# EAGLE design FM Radio Simple Receiver (EAGLE 7.2.0)
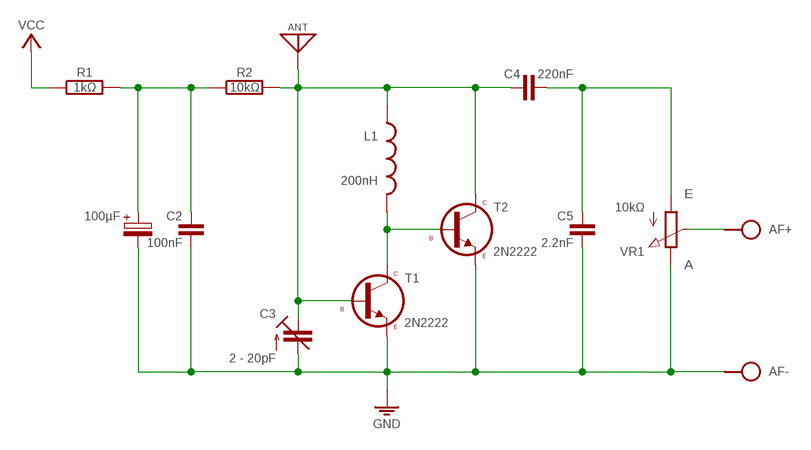
[diagram p0: schematic, sheet 1]

## Parts
100µF  CPOLE2,5-5/V  [E2,5-5/V]
AF  SPAD+-+-  [SPAD+-]
ANT  ANT  [SPAD]
BAT  VCC_GNDL  [SPAD-+]
C2  100nF  C050-020X036/V  [C050-020X036/V]
C3  2 - 20pF  C-TR-PH20127  [TRIM-2222-808]
C4  220nF  C-H050-020X044  [C050-020X044]
C5  2.2nF  C050-020X036/V  [C050-020X036/V]
L1  200nH  L04/7-V  [L-04/7-V]
R1  1kΩ  R-H0204/10  [0204/10]
R2  10kΩ  R-H0204/10  [0204/10]
T1  2N2222  [TO92-EBC]
T2  2N2222  [TO92-EBC]
VR1  10kΩ  POT  [POT]

## Nets
GND: 100µF.- AF.1 BAT.1 C2.2 C3.1(A) C3.3(A) C5.2 T1.E T2.E VR1.E
N$1: ANT.1 C3.2(E) C4.1 L1.1 R2.2 T1.B T2.C
N$2: 100µF.+ C2.1 R1.2 R2.1
N$3: C4.2 C5.1 VR1.A
N$5: L1.2 T1.C T2.B
N$6: AF.2 VR1.S
VCC: BAT.2 R1.1

## Library data of the parts
100µF = c:CPOL: POLARIZED CAPACITOR, European symbol
AF = pad:SPAD+-
ANT = pad:ANT
BAT = pad:VCC_GND
C2 C5 = c:C: CAPACITOR, European symbol
C3 = cap-trim:C-TR-PH20127
C4 = c:C-H
L1 = l:L: Potentiometers Beckman, Copal, Piher, Spectrol, Schukat Created by librarian@cadsoft.de
R1 R2 = r:R-H
T1 T2 = t:2N2222
VR1 = r:POT

## Board
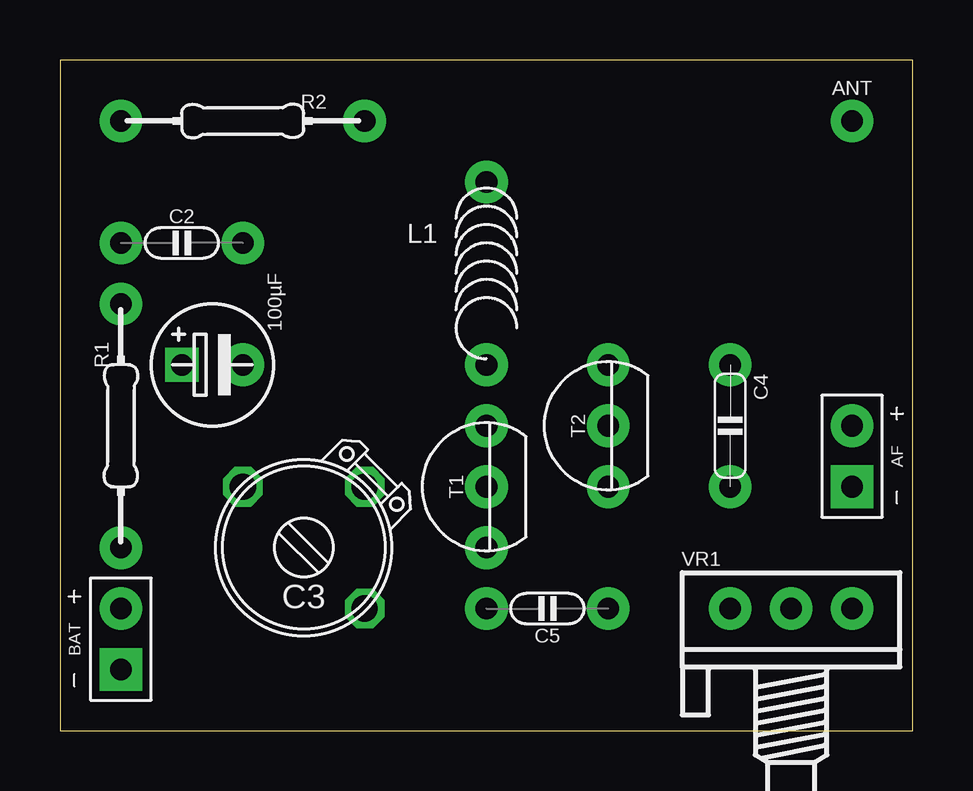
[diagram p1: board, top side]
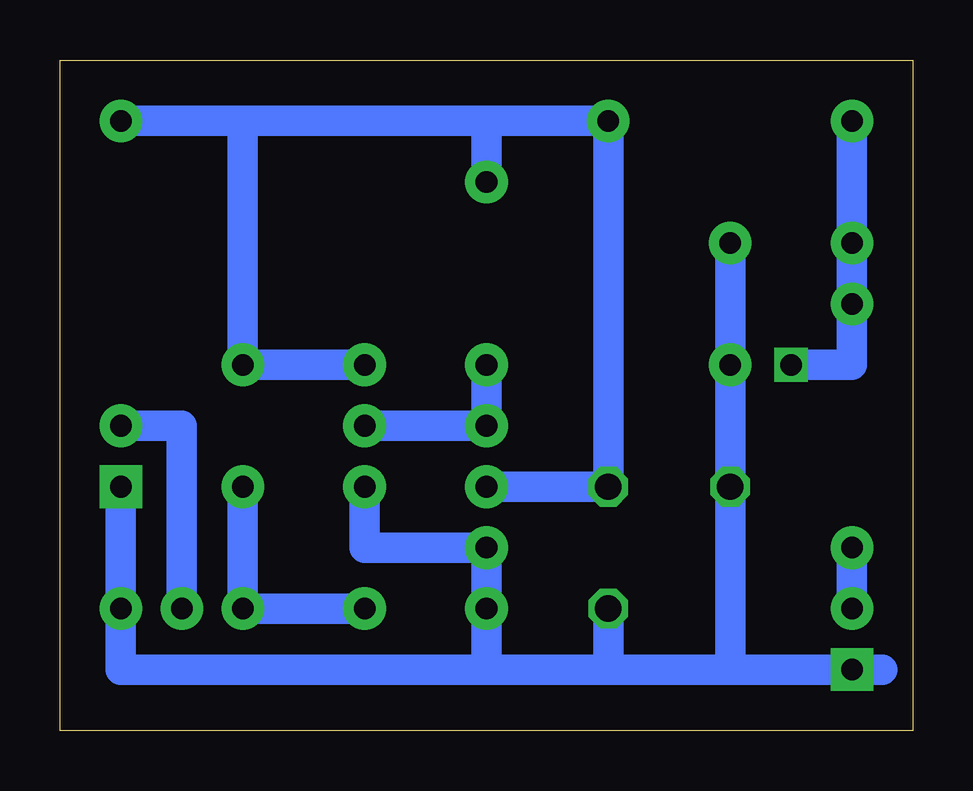
[diagram p2: board, bottom side, seen from below]

Size 35.56 x 27.94 mm. Coordinates in mm from the lower left corner, seen from the top.
Outline: 0,0 35.56,0 35.56,27.94 0,27.94 0,0
Copper layers (1*16): Top 0.035mm / dielectric 1.5mm / Bottom 0.035mm
Design rules "default": minimum track width 10mil, minimum drill 24mil, track to track 8mil, track to pad 8mil, pad to pad 8mil, via to via 8mil, smd to smd 8mil, copper to edge 40mil, drill to drill 8mil, minimum pad ring 10mil, minimum via ring 8mil, stop-mask expansion 4mil, vias tented up to drill 0mil, thermal gap 10mil

### Footprints (pad centres in the part's own frame; a part is rotated, then mirrored left to right if it is on the bottom)
E2,5-5/V = drill 0.9 square: + 0,-1.27 | drill 0.9 pad 1.778: - 0,1.27
SPAD+- = drill 0.9 pad 1.778 square: 1 0,-1.27 | drill 0.9 pad 1.778: 2 0,1.27
SPAD = drill 0.9 pad 1.778: 1 0,0
SPAD-+ = drill 0.9 pad 1.778 square: 1 0,-1.27 | drill 0.9 pad 1.778: 2 0,1.27
C050-020X036/V = drill 0.9 pad 1.778: 1 0,-2.54; 2 0,2.54
TRIM-2222-808 = drill 1.1 octagon: 1 -2.54,2.54; 2 -2.54,-2.54; 3 2.54,-2.54
C050-020X044 = drill 0.9 pad 1.778: 1 -2.54,0; 2 2.54,0
L-04/7-V = drill 0.9 pad 1.778: 1 0,3.81; 2 0,-3.81
0204/10 = drill 0.9 pad 1.778: 1 -5.08,0; 2 5.08,0
TO92-EBC = drill 0.9 pad 1.778: B 0,0; C 0,-2.54; E 0,2.54
POT = drill 0.9 pad 1.778: A -2.54,0; E 2.54,0; S 0,0

### Placement (x,y rotation side)
100µF  6.35,15.24 270 top
AF  33.02,11.43 0 top
ANT  33.02,25.4 270 top
BAT  2.54,3.81 0 top
C2  5.08,20.32 270 top
C3  10.16,7.62 180 top
C4  27.94,12.7 270 top
C5  20.32,5.08 90 top
L1  17.78,19.05 0 top
R1  2.54,12.7 90 top
R2  7.62,25.4 0 top
T1  17.78,10.16 180 top
T2  22.86,12.7 180 top
VR1  30.48,5.08 0 top

### Tracks (layer width: path | path; a pad name or v marks a point on that pad's centre or on a via)
GND
  Bottom 1.27: T2.E 22.86,7.62 T1.E C5.2 17.78,2.54 | VR1.E AF.1 33.02,2.54 17.78,2.54 | C2.2 100µF.- C3.3 7.62,2.54 | 17.78,2.54 12.7,2.54 | 12.7,2.54 7.62,2.54 | 7.62,2.54 BAT.1 1.27,2.54 | 12.7,2.54 C3.1
N$1
  Bottom 1.27: 27.94,25.4 C4.1 T2.C | 27.94,25.4 17.78,25.4 | T1.B C3.2 R2.2 17.78,25.4 | ANT.1 27.94,25.4 | 17.78,25.4 L1.1
N$2
  Bottom 1.27: R2.1 C2.1 R1.2 2.54,15.24 100µF.+
N$3
  Bottom 1.27: C5.1 VR1.A C4.2
N$5
  Bottom 1.27: T2.B T1.C L1.2
N$6
  Bottom 1.27: VR1.S 30.48,12.7 AF.2
VCC
  Bottom 1.27: BAT.2 R1.1